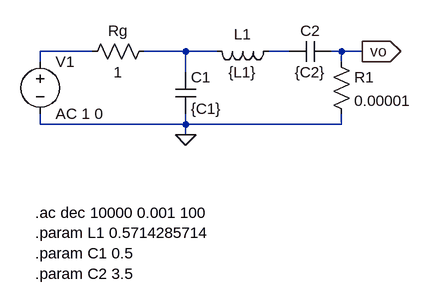
[diagram p0: schematic Ejercicio2.asc]
Ejercicio2.asc, the LTspice schematic file:
Version 4
SHEET 1 880 680
WIRE 80 112 0 112
WIRE 224 112 160 112
WIRE 272 112 224 112
WIRE 384 112 352 112
WIRE 464 112 448 112
WIRE 496 112 464 112
WIRE 0 128 0 112
WIRE 464 128 464 112
WIRE 224 144 224 112
WIRE 0 224 0 208
WIRE 224 224 224 208
WIRE 224 224 0 224
WIRE 464 224 464 208
WIRE 464 224 224 224
WIRE 224 240 224 224
FLAG 224 240 0
FLAG 496 112 vo
IOPIN 496 112 Out
SYMBOL res 176 96 R90
WINDOW 0 0 56 VBottom 2
WINDOW 3 32 56 VTop 2
SYMATTR InstName Rg
SYMATTR Value 1
SYMBOL cap 208 144 R0
SYMATTR InstName C1
SYMATTR Value {C1}
SYMBOL ind 368 96 R90
WINDOW 0 5 56 VBottom 2
WINDOW 3 32 56 VTop 2
SYMATTR InstName L1
SYMATTR Value {L1}
SYMBOL cap 448 96 R90
WINDOW 0 0 32 VBottom 2
WINDOW 3 32 32 VTop 2
SYMATTR InstName C2
SYMATTR Value {C2}
SYMBOL voltage 0 112 R0
SYMATTR InstName V1
SYMATTR Value AC 1 0
SYMBOL res 448 112 R0
SYMATTR InstName R1
SYMATTR Value 0.00001
TEXT -8 360 Left 2 !.ac dec 10000 0.001 100\n.param L1 0.5714285714\n.param C1 0.5\n.param C2 3.5

The netlist it stands for:
* Ejercicio2.asc
Rg N002 N001 1
C1 N002 0 {C1}
L1 N003 N002 {L1}
C2 vo N003 {C2}
V1 N001 0 AC 1 0
R1 vo 0 0.00001
.ac dec 10000 0.001 100
.param L1 0.5714285714
.param C1 0.5
.param C2 3.5
.backanno
.end